# Altium schematic sheet LOINA.SchDoc: DDS INA
size A4; Organization: Altium Limited; Address1: L3, 12a Rodborough Rd; Address2: Frenchs Forest; Address3: NSW; Address4: Australia 2086
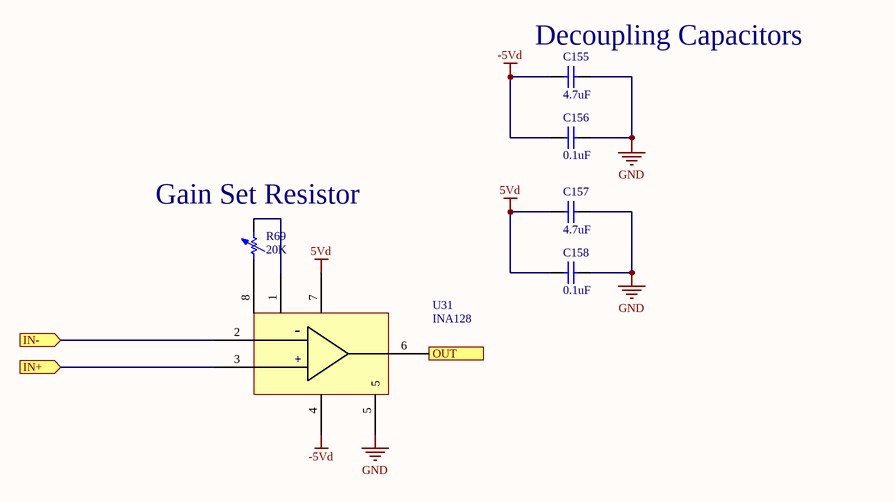
[diagram p0: LOINA.SchDoc]

## Parts
C155  4.7uF  [0402_Cap]
C156  0.1uF  [0402_Cap]
C157  4.7uF  [0402_Cap]
C158  0.1uF  [0402_Cap]
R69  20K  [TRIMRES]
U31  INA128  [SOIC_8]

## Ports
IN+ (in), IN- (in), OUT (out)

## Nets
5Vd: C157.1 C158.1 U31.7
-5Vd: C155.1 C156.1 U31.4
GND: C155.2 C156.2 C157.2 C158.2 U31.5
IN+: U31.3 ; port IN+
IN-: U31.2 ; port IN-
OUT: U31.6 ; port OUT
NetR69_1: R69.1 U31.8(Gain)
NetR69_2: R69.2 U31.1(Gain)

## Notes on the sheet
- (near C155) Decoupling Capacitors
- (near R69) Gain Set Resistor
- Title
- Date:
- RE:
- Arturo di Girolamo
- Size:
- A3
- A
- (in symbol INA128UA/2K5) -; +

## Library data of the parts
C155 C157 = CL21A475KAQNNNE: Capacitor, 4.7uF, 0805; Value: .01uf; ASYPN: GRM155R61A475MEAAD; MFGPN: CL21A475KAQNNNE
C156 C158 = CL21B104KACNNNC: Capacitor, 0.1uF, 0805; Value: .01uf; ASYPN: 0402YC104KAT2A; MFGPN: CL21B104KACNNNC
R69 = PV36W102C01B00_RES: Variable resistor 1k; MFGPN: PV36W102C01B00
U31 = INA128UA/2K5: Instrumentation Amp, Generic; ASYPN: INA828IDR; MFGPN: INA128UA/2K5